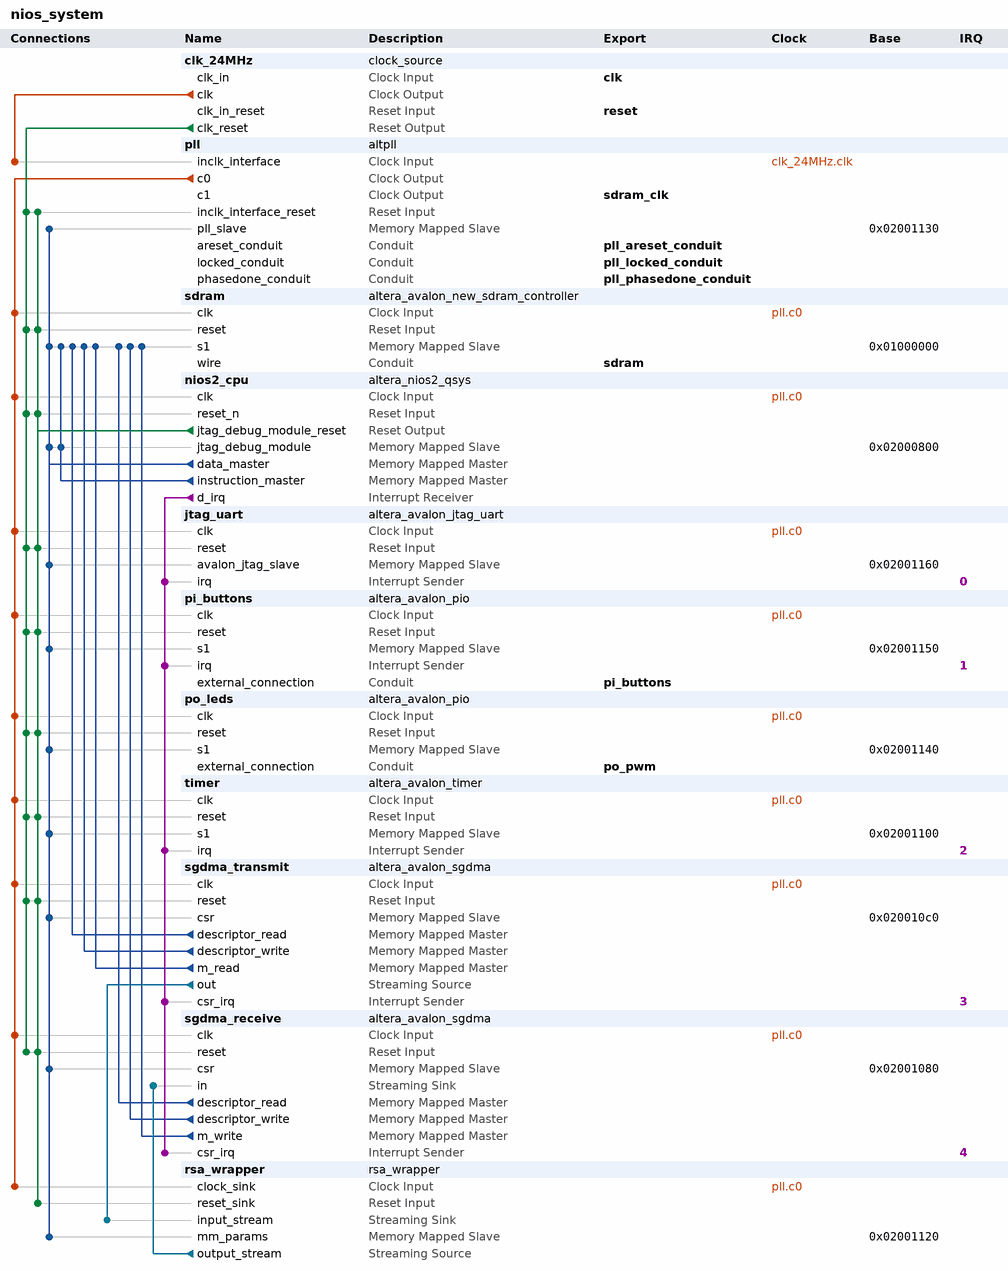
[diagram p0: system contents]
# Platform Designer (Qsys) system nios_system, Cyclone IV E EP4CE22F17C6
# Parameters at their usual value, and those the tool derives, are not listed.
package require -exact qsys 13.0.1
create_system nios_system
set_project_property DEVICE_FAMILY {Cyclone IV E}
set_project_property DEVICE EP4CE22F17C6

add_instance clk_24MHz clock_source 13.0
set_instance_parameter_value clk_24MHz clockFrequency 50000000

add_instance pll altpll 13.0
set_instance_parameter_value pll INCLK0_INPUT_FREQUENCY 20000
set_instance_parameter_value pll GATE_LOCK_SIGNAL NO
set_instance_parameter_value pll VALID_LOCK_MULTIPLIER 1
set_instance_parameter_value pll INVALID_LOCK_MULTIPLIER 5
set_instance_parameter_value pll CLK0_MULTIPLY_BY 2
set_instance_parameter_value pll CLK1_MULTIPLY_BY 2
set_instance_parameter_value pll CLK0_DIVIDE_BY 1
set_instance_parameter_value pll CLK1_DIVIDE_BY 1
set_instance_parameter_value pll CLK1_PHASE_SHIFT 0
set_instance_parameter_value pll CLK1_DUTY_CYCLE 50
set_instance_parameter_value pll PORT_clk1 PORT_USED
set_instance_parameter_value pll PORT_clk2 PORT_UNUSED
set_instance_parameter_value pll PORT_clk3 PORT_UNUSED
set_instance_parameter_value pll PORT_ARESET PORT_USED
set_instance_parameter_value pll PORT_LOCKED PORT_USED

add_instance sdram altera_avalon_new_sdram_controller 13.0.1
set_instance_parameter_value sdram TAC 5.5
set_instance_parameter_value sdram TRCD 20.0
set_instance_parameter_value sdram TRP 20.0
set_instance_parameter_value sdram casLatency 3
set_instance_parameter_value sdram columnWidth 9
set_instance_parameter_value sdram dataWidth 16
set_instance_parameter_value sdram generateSimulationModel false
set_instance_parameter_value sdram model single_Micron_MT48LC4M32B2_7_chip
set_instance_parameter_value sdram numberOfBanks 4
set_instance_parameter_value sdram numberOfChipSelects 1
set_instance_parameter_value sdram powerUpDelay 100.0
set_instance_parameter_value sdram refreshPeriod 15.625
set_instance_parameter_value sdram rowWidth 12

add_instance nios2_cpu altera_nios2_qsys 13.0
set_instance_parameter_value nios2_cpu muldiv_divider true
set_instance_parameter_value nios2_cpu resetSlave sdram.s1
set_instance_parameter_value nios2_cpu mmu_TLBMissExcSlave None
set_instance_parameter_value nios2_cpu exceptionSlave sdram.s1
set_instance_parameter_value nios2_cpu breakSlave nios2_cpu.jtag_debug_module
set_instance_parameter_value nios2_cpu impl Tiny
set_instance_parameter_value nios2_cpu icache_size 4096

add_instance jtag_uart altera_avalon_jtag_uart 13.0.1
set_instance_parameter_value jtag_uart simInteractiveOptions NO_INTERACTIVE_WINDOWS

add_instance pi_buttons altera_avalon_pio 13.0.1
set_instance_parameter_value pi_buttons bitClearingEdgeCapReg true
set_instance_parameter_value pi_buttons captureEdge true
set_instance_parameter_value pi_buttons direction Input
set_instance_parameter_value pi_buttons generateIRQ true
set_instance_parameter_value pi_buttons irqType EDGE
set_instance_parameter_value pi_buttons width 2

add_instance po_leds altera_avalon_pio 13.0.1
set_instance_parameter_value po_leds direction Output
set_instance_parameter_value po_leds resetValue 255
set_instance_parameter_value po_leds width 8

add_instance timer altera_avalon_timer 13.0.1
set_instance_parameter_value timer period 1
set_instance_parameter_value timer periodUnits MSEC

add_instance sgdma_transmit altera_avalon_sgdma 13.0.1
set_instance_parameter_value sgdma_transmit avalonMMByteReorderMode 1
set_instance_parameter_value sgdma_transmit enableBurstTransfers false
set_instance_parameter_value sgdma_transmit enableUnalignedTransfers false
set_instance_parameter_value sgdma_transmit readBlockDataWidth 32
set_instance_parameter_value sgdma_transmit sinkErrorWidth 0
set_instance_parameter_value sgdma_transmit sourceErrorWidth 0
set_instance_parameter_value sgdma_transmit transferMode MEMORY_TO_STREAM
set_instance_parameter_value sgdma_transmit writeBurstcountWidth 4

add_instance sgdma_receive altera_avalon_sgdma 13.0.1
set_instance_parameter_value sgdma_receive avalonMMByteReorderMode 1
set_instance_parameter_value sgdma_receive enableBurstTransfers false
set_instance_parameter_value sgdma_receive enableUnalignedTransfers false
set_instance_parameter_value sgdma_receive readBlockDataWidth 32
set_instance_parameter_value sgdma_receive sinkErrorWidth 0
set_instance_parameter_value sgdma_receive sourceErrorWidth 0
set_instance_parameter_value sgdma_receive transferMode STREAM_TO_MEMORY
set_instance_parameter_value sgdma_receive writeBurstcountWidth 4

add_instance rsa_wrapper rsa_wrapper 1.0
set_instance_parameter_value rsa_wrapper BITSIZE 256

# connections
add_connection clk_24MHz.clk pll.inclk_interface clock
add_connection pll.c0 jtag_uart.clk clock
add_connection pll.c0 nios2_cpu.clk clock
add_connection pll.c0 pi_buttons.clk clock
add_connection pll.c0 po_leds.clk clock
add_connection pll.c0 rsa_wrapper.clock_sink clock
add_connection pll.c0 sdram.clk clock
add_connection pll.c0 sgdma_receive.clk clock
add_connection pll.c0 sgdma_transmit.clk clock
add_connection pll.c0 timer.clk clock
add_connection clk_24MHz.clk_reset jtag_uart.reset reset
add_connection clk_24MHz.clk_reset nios2_cpu.reset_n reset
add_connection clk_24MHz.clk_reset pi_buttons.reset reset
add_connection clk_24MHz.clk_reset pll.inclk_interface_reset reset
add_connection clk_24MHz.clk_reset po_leds.reset reset
add_connection clk_24MHz.clk_reset sdram.reset reset
add_connection clk_24MHz.clk_reset sgdma_receive.reset reset
add_connection clk_24MHz.clk_reset sgdma_transmit.reset reset
add_connection clk_24MHz.clk_reset timer.reset reset
add_connection nios2_cpu.jtag_debug_module_reset jtag_uart.reset reset
add_connection nios2_cpu.jtag_debug_module_reset nios2_cpu.reset_n reset
add_connection nios2_cpu.jtag_debug_module_reset pi_buttons.reset reset
add_connection nios2_cpu.jtag_debug_module_reset pll.inclk_interface_reset reset
add_connection nios2_cpu.jtag_debug_module_reset po_leds.reset reset
add_connection nios2_cpu.jtag_debug_module_reset rsa_wrapper.reset_sink reset
add_connection nios2_cpu.jtag_debug_module_reset sdram.reset reset
add_connection nios2_cpu.jtag_debug_module_reset sgdma_receive.reset reset
add_connection nios2_cpu.jtag_debug_module_reset sgdma_transmit.reset reset
add_connection nios2_cpu.jtag_debug_module_reset timer.reset reset
add_connection nios2_cpu.data_master jtag_uart.avalon_jtag_slave avalon
set_connection_parameter_value nios2_cpu.data_master/jtag_uart.avalon_jtag_slave baseAddress 0x02001160
add_connection nios2_cpu.data_master nios2_cpu.jtag_debug_module avalon
set_connection_parameter_value nios2_cpu.data_master/nios2_cpu.jtag_debug_module baseAddress 0x02000800
add_connection nios2_cpu.data_master pi_buttons.s1 avalon
set_connection_parameter_value nios2_cpu.data_master/pi_buttons.s1 baseAddress 0x02001150
add_connection nios2_cpu.data_master pll.pll_slave avalon
set_connection_parameter_value nios2_cpu.data_master/pll.pll_slave baseAddress 0x02001130
add_connection nios2_cpu.data_master po_leds.s1 avalon
set_connection_parameter_value nios2_cpu.data_master/po_leds.s1 baseAddress 0x02001140
add_connection nios2_cpu.data_master rsa_wrapper.mm_params avalon
set_connection_parameter_value nios2_cpu.data_master/rsa_wrapper.mm_params baseAddress 0x02001120
add_connection nios2_cpu.data_master sdram.s1 avalon
set_connection_parameter_value nios2_cpu.data_master/sdram.s1 baseAddress 0x01000000
add_connection nios2_cpu.data_master sgdma_receive.csr avalon
set_connection_parameter_value nios2_cpu.data_master/sgdma_receive.csr baseAddress 0x02001080
add_connection nios2_cpu.data_master sgdma_transmit.csr avalon
set_connection_parameter_value nios2_cpu.data_master/sgdma_transmit.csr baseAddress 0x020010c0
add_connection nios2_cpu.data_master timer.s1 avalon
set_connection_parameter_value nios2_cpu.data_master/timer.s1 baseAddress 0x02001100
add_connection nios2_cpu.instruction_master nios2_cpu.jtag_debug_module avalon
set_connection_parameter_value nios2_cpu.instruction_master/nios2_cpu.jtag_debug_module baseAddress 0x02000800
add_connection nios2_cpu.instruction_master sdram.s1 avalon
set_connection_parameter_value nios2_cpu.instruction_master/sdram.s1 baseAddress 0x01000000
add_connection sgdma_receive.descriptor_read sdram.s1 avalon
set_connection_parameter_value sgdma_receive.descriptor_read/sdram.s1 baseAddress 0x01000000
add_connection sgdma_receive.descriptor_write sdram.s1 avalon
set_connection_parameter_value sgdma_receive.descriptor_write/sdram.s1 baseAddress 0x01000000
add_connection sgdma_receive.m_write sdram.s1 avalon
set_connection_parameter_value sgdma_receive.m_write/sdram.s1 baseAddress 0x01000000
add_connection sgdma_transmit.descriptor_read sdram.s1 avalon
set_connection_parameter_value sgdma_transmit.descriptor_read/sdram.s1 baseAddress 0x01000000
add_connection sgdma_transmit.descriptor_write sdram.s1 avalon
set_connection_parameter_value sgdma_transmit.descriptor_write/sdram.s1 baseAddress 0x01000000
add_connection sgdma_transmit.m_read sdram.s1 avalon
set_connection_parameter_value sgdma_transmit.m_read/sdram.s1 baseAddress 0x01000000
add_connection rsa_wrapper.output_stream sgdma_receive.in avalon_streaming
add_connection sgdma_transmit.out rsa_wrapper.input_stream avalon_streaming
add_connection nios2_cpu.d_irq jtag_uart.irq interrupt
set_connection_parameter_value nios2_cpu.d_irq/jtag_uart.irq irqNumber 0
add_connection nios2_cpu.d_irq pi_buttons.irq interrupt
set_connection_parameter_value nios2_cpu.d_irq/pi_buttons.irq irqNumber 1
add_connection nios2_cpu.d_irq sgdma_receive.csr_irq interrupt
set_connection_parameter_value nios2_cpu.d_irq/sgdma_receive.csr_irq irqNumber 4
add_connection nios2_cpu.d_irq sgdma_transmit.csr_irq interrupt
set_connection_parameter_value nios2_cpu.d_irq/sgdma_transmit.csr_irq irqNumber 3
add_connection nios2_cpu.d_irq timer.irq interrupt
set_connection_parameter_value nios2_cpu.d_irq/timer.irq irqNumber 2

# exported interfaces
add_interface clk clock sink
set_interface_property clk EXPORT_OF clk_24MHz.clk_in
add_interface reset reset sink
set_interface_property reset EXPORT_OF clk_24MHz.clk_in_reset
add_interface sdram_clk clock source
set_interface_property sdram_clk EXPORT_OF pll.c1
add_interface pll_areset_conduit conduit end
set_interface_property pll_areset_conduit EXPORT_OF pll.areset_conduit
add_interface pll_locked_conduit conduit end
set_interface_property pll_locked_conduit EXPORT_OF pll.locked_conduit
add_interface pll_phasedone_conduit conduit end
set_interface_property pll_phasedone_conduit EXPORT_OF pll.phasedone_conduit
add_interface sdram conduit end
set_interface_property sdram EXPORT_OF sdram.wire
add_interface pi_buttons conduit end
set_interface_property pi_buttons EXPORT_OF pi_buttons.external_connection
add_interface po_pwm conduit end
set_interface_property po_pwm EXPORT_OF po_leds.external_connection

set_interconnect_requirement {$system} qsys_mm.clockCrossingAdapter HANDSHAKE
set_interconnect_requirement {$system} qsys_mm.maxAdditionalLatency 1

save_system nios_system.qsys
